# Altium schematic sheet [02] - BLOCK DIAGRAM.SchDoc: DOCUMENT TITLE
size A4; Organization: Tor Brodtkorb; Address1: Frode Rinnans veg 193; Address2: 7050 Trondheim; DocumentNumber: 6598; Revision: 1.0; SheetNumber: 1; SheetTotal: 1
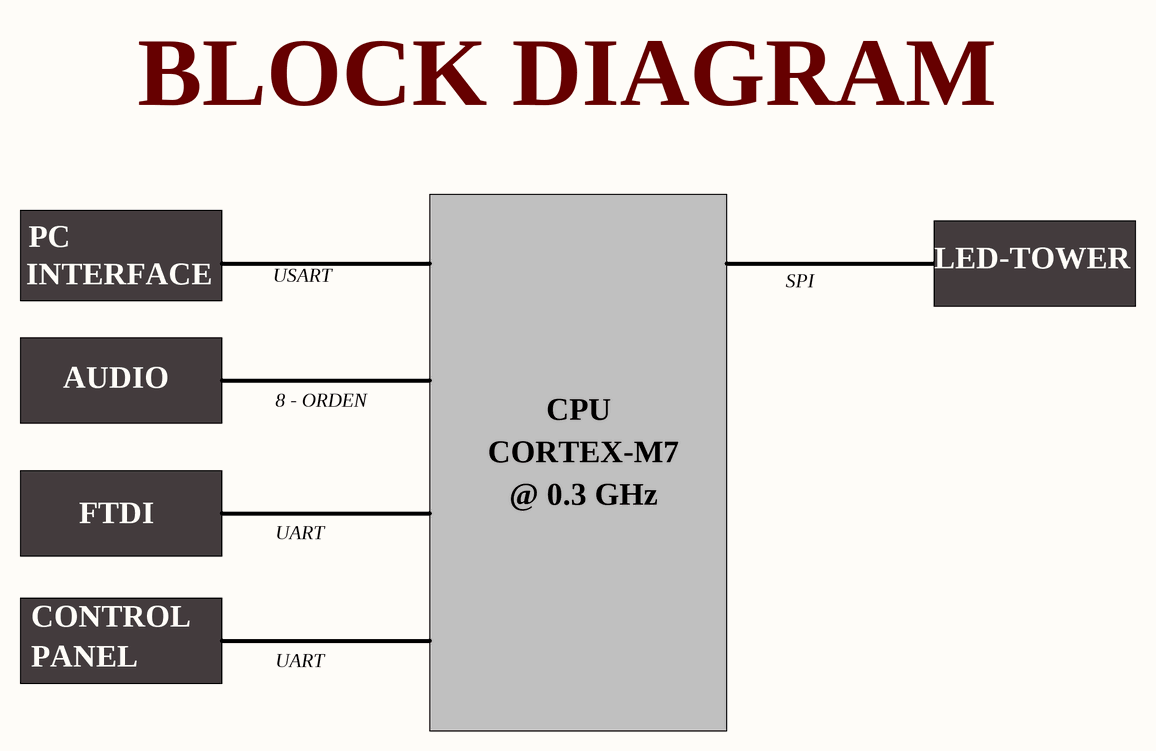
[diagram p0: [02] - BLOCK DIAGRAM.SchDoc]

## Notes on the sheet
- BLOCK DIAGRAM
- PC
- LED-TOWER
- INTERFACE
- USART
- SPI
- AUDIO
- 8 - ORDEN
- CORTEX-M7
- CPU
- FTDI
- UART
- @ 0.3 GHz
- CONTROL
- PANEL
- Title
- Size:
- Date:
- A4
- Number:
- Time:
- Revision:
- Sheet
- of
- File: